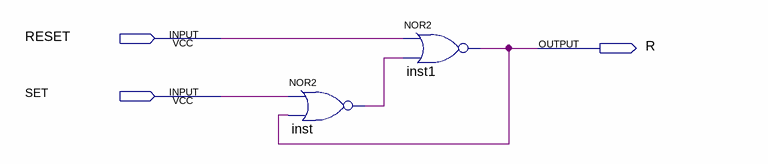
[diagram p0: schematic sheet]
// Quartus schematic set_reset.bdf as structural Verilog: 2 symbols, 3 pins
module set_reset (
  input  RESET,
  input  SET,
  output R
);

  wire inst_out;

  nor inst (inst_out, SET, R);
  nor inst1 (R, RESET, inst_out);
endmodule
